# Altium schematic sheet 43.SchDoc
size A4
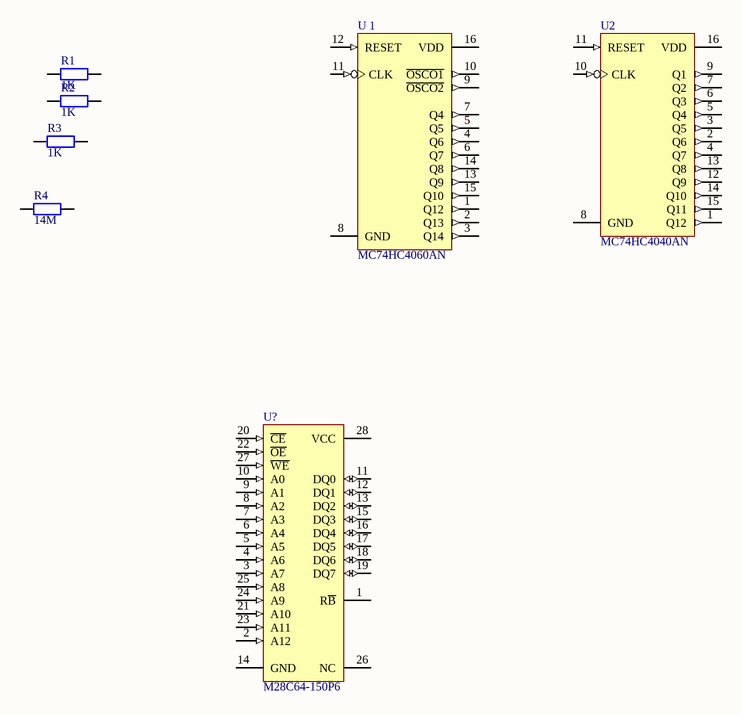
[diagram p0: 43.SchDoc]

## Parts
R1  value 1K  [AXIAL-0.4]  (hidden comment: Res2)
R2  value 1K  [AXIAL-0.4]  (hidden comment: Res2)
R3  value 1K  [AXIAL-0.4]  (hidden comment: Res2)
R4  value 14M  [AXIAL-0.4]  (hidden comment: Res2)
U2  MC74HC4040AN  [648-08]
U?  M28C64-150P6  [PDIP28]
U_1  MC74HC4060AN  [648-08]

## Nets

Not connected (* = marked no-connect by the designer): R1 1 2; R2 1 2; R3 1 2; R4 1 2; U2 1(Q12) 2(Q6) 3(Q5) 4(Q7) 5(Q4) 6(Q3) 7(Q2) 8(GND) 9(Q1) 10(CLK) 11(RESET) 12(Q9) 13(Q8) 14(Q10) 15(Q11) 16(VDD); U? 1(R~{B}) 2(A12) 3(A7) 4(A6) 5(A5) 6(A4) 7(A3) 8(A2) 9(A1) 10(A0) 11(DQ0) 12(DQ1) 13(DQ2) 14(GND) 15(DQ3) 16(DQ4) 17(DQ5) 18(DQ6) 19(DQ7) 20(~{CE}) 21(A10) 22(~{OE}) 23(A11) 24(A9) 25(A8) 26(NC) 27(~{WE}) 28(VCC); U_1 1(Q12) 2(Q13) 3(Q14) 4(Q6) 5(Q5) 6(Q7) 7(Q4) 8(GND) 9(~{OSCO2}) 10(~{OSCO1}) 11(CLK) 12(RESET) 13(Q9) 14(Q8) 15(Q10) 16(VDD)

## Library data of the parts
R1-R4 = Res2: Resistor; Published: 8-Jun-2000; LatestRevisionDate: 17-Jul-2002; LatestRevisionNote: Re-released for DXP Platform.; Publisher: Altium Limited
U2 = MC74HC4040AN: 12-Stage Binary Ripple Counter; Published: 15-Apr-2002; DatasheetDocument: Mar-2000; PackageDocument: Apr-2000; PackageReference: 648-08; Publisher: Altium Limited; Code_JEDEC: MS-001-BB
U? = M28C64-150P6: Parallel 64 Kbit (8K x 8) EEPROM with Software Data Protection; Published: 24-Aug-2001; LatestRevisionDate: 17-Jul-2002; LatestRevisionNote: Re-released for DXP Platform.; DatasheetDocument: Jun-1996; PackageDocument: Jan-2003; PackageReference: PDIP28; Publisher: Altium Limited
U_1 = MC74HC4060AN: 14-Stage Binary Ripple Counter with Oscillator; Published: 15-Apr-2002; DatasheetDocument: Mar-2000; PackageDocument: Apr-2000; PackageReference: 648-08; Publisher: Altium Limited; Code_JEDEC: MS-001-BB